# Altium schematic sheet DDR3_1.SchDoc
size A4; DocumentNumber: 13; SheetNumber: 13; SheetTotal: 47
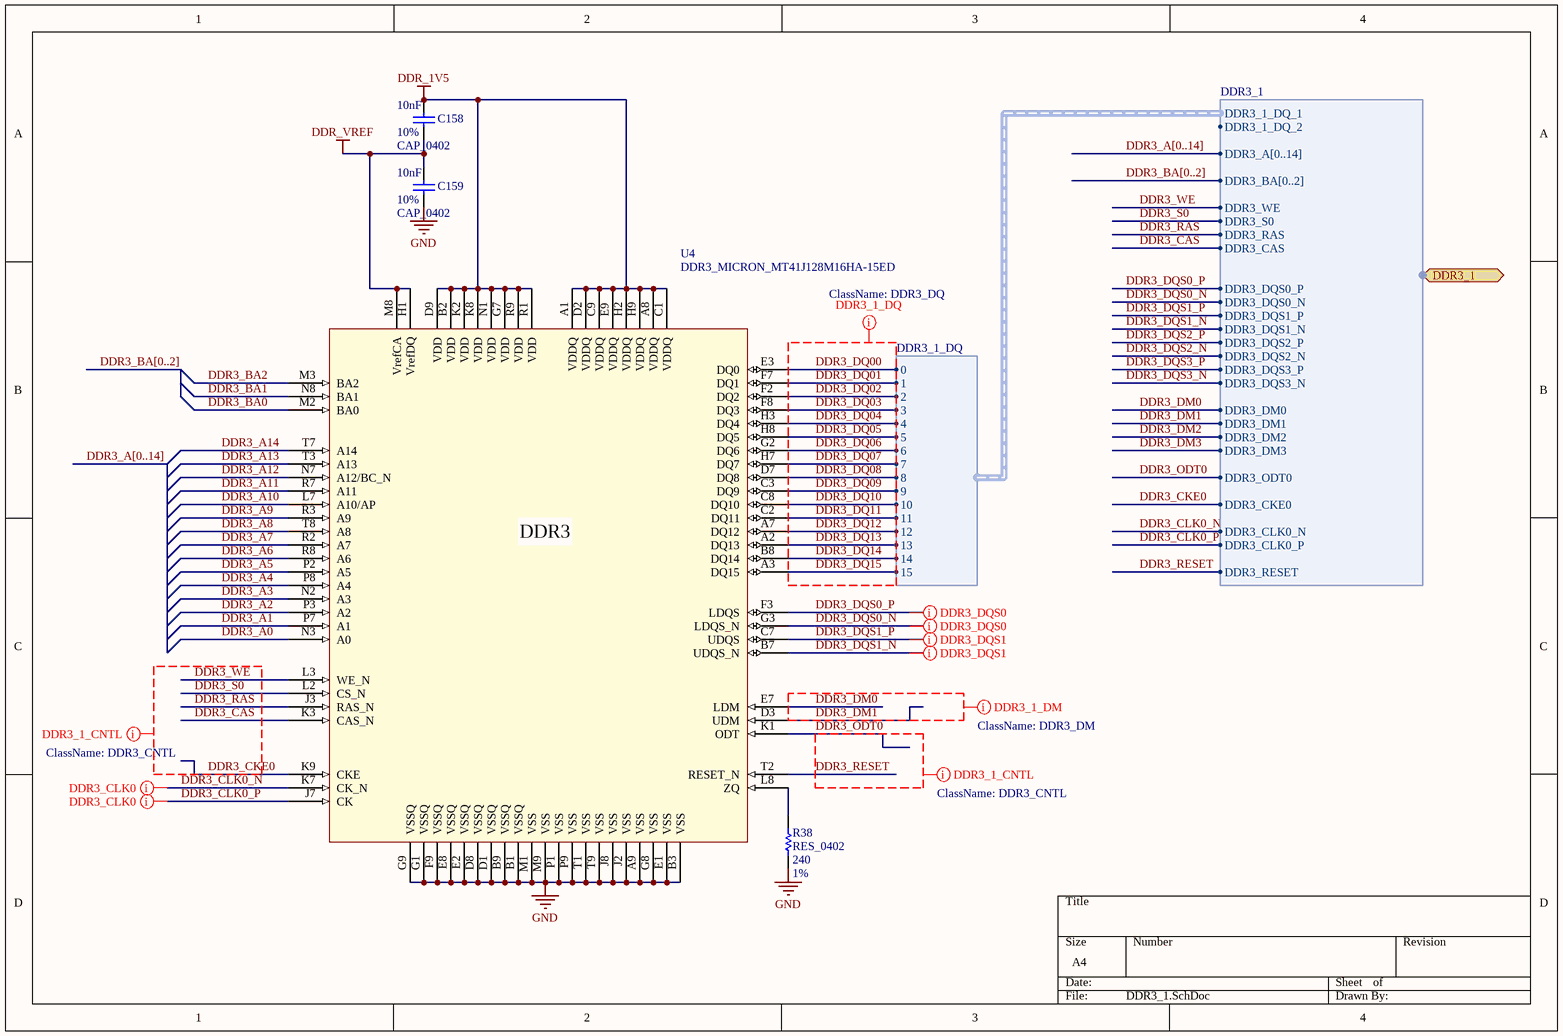
[diagram p0: DDR3_1.SchDoc]

## Parts
C158  CAP_0402  value 10nF  Tolerance: 10%  [CAPC0402(1005)60_N]
C159  CAP_0402  value 10nF  Tolerance: 10%  [CAPC0402(1005)60_N]
R38  RES_0402  value 240  Tolerance: 1%  [RESC0402(1005)_N]
U4  DDR3_MICRON_MT41J128M16HA-15ED  [DDR3_MICRON_MT41J128M16HA-15ED_FBGA96]

## Ports
DDR3_1 (harness DDR3_1)

## Harnesses
DDR3_1: DDR3_1_DQ_1, DDR3_1_DQ_2, DDR3_A[0..14], DDR3_BA[0..2], DDR3_WE, DDR3_S0, DDR3_RAS, DDR3_CAS, DDR3_DQS0_P, DDR3_DQS0_N, DDR3_DQS1_P, DDR3_DQS1_N, DDR3_DQS2_P, DDR3_DQS2_N, DDR3_DQS3_P, DDR3_DQS3_N, DDR3_DM0, DDR3_DM1, DDR3_DM2, DDR3_DM3, DDR3_ODT0, DDR3_CKE0, DDR3_CLK0_N, DDR3_CLK0_P, DDR3_RESET
DDR3_1_DQ: 0, 1, 2, 3, 4, 5, 6, 7, 8, 9, 10, 11, 12, 13, 14, 15

## Nets
DDR_1V5: C158.2 U4.A1(VDDQ) U4.A8(VDDQ) U4.B2(VDD) U4.C1(VDDQ) U4.C9(VDDQ) U4.D2(VDDQ) U4.D9(VDD) U4.E9(VDDQ) U4.G7(VDD) U4.H2(VDDQ) U4.H9(VDDQ) U4.K2(VDD) U4.K8(VDD) U4.N1(VDD) U4.R1(VDD) U4.R9(VDD)
DDR_VREF: C158.1 C159.2 U4.H1(VrefDQ) U4.M8(VrefCA)
GND: C159.1 R38.1 U4.A9(VSS) U4.B1(VSSQ) U4.B3(VSS) U4.B9(VSSQ) U4.D1(VSSQ) U4.D8(VSSQ) U4.E1(VSS) U4.E2(VSSQ) U4.E8(VSSQ) U4.F9(VSSQ) U4.G1(VSSQ) U4.G8(VSS) U4.G9(VSSQ) U4.J2(VSS) U4.J8(VSS) U4.M1(VSS) U4.M9(VSS) U4.P1(VSS) U4.P9(VSS) U4.T1(VSS) U4.T9(VSS)
DDR3_A0: U4.N3(A0)
DDR3_A1: U4.P7(A1)
DDR3_A2: U4.P3(A2)
DDR3_A3: U4.N2(A3)
DDR3_A4: U4.P8(A4)
DDR3_A5: U4.P2(A5)
DDR3_A6: U4.R8(A6)
DDR3_A7: U4.R2(A7)
DDR3_A8: U4.T8(A8)
DDR3_A9: U4.R3(A9)
DDR3_A10: U4.L7(A10/AP)
DDR3_A11: U4.R7(A11)
DDR3_A12: U4.N7(A12/BC_N)
DDR3_A13: U4.T3(A13)
DDR3_A14: U4.T7(A14)
DDR3_BA0: U4.M2(BA0)
DDR3_BA1: U4.N8(BA1)
DDR3_BA2: U4.M3(BA2)
DDR3_CAS: U4.K3(CAS_N) ; port DDR3_1.DDR3_CAS
DDR3_CKE0: U4.K9(CKE) ; port DDR3_1.DDR3_CKE0
DDR3_CLK0_N: U4.K7(CK_N) ; port DDR3_1.DDR3_CLK0_N
DDR3_CLK0_P: U4.J7(CK) ; port DDR3_1.DDR3_CLK0_P
DDR3_DM0: U4.E7(LDM) ; port DDR3_1.DDR3_DM0
DDR3_DM1: U4.D3(UDM) ; port DDR3_1.DDR3_DM1
DDR3_DM2: port DDR3_1.DDR3_DM2
DDR3_DM3: port DDR3_1.DDR3_DM3
DDR3_DQ00: U4.E3(DQ0) ; harness DDR3_1_DQ.0
DDR3_DQ01: U4.F7(DQ1) ; harness DDR3_1_DQ.1
DDR3_DQ02: U4.F2(DQ2) ; harness DDR3_1_DQ.2
DDR3_DQ03: U4.F8(DQ3) ; harness DDR3_1_DQ.3
DDR3_DQ04: U4.H3(DQ4) ; harness DDR3_1_DQ.4
DDR3_DQ05: U4.H8(DQ5) ; harness DDR3_1_DQ.5
DDR3_DQ06: U4.G2(DQ6) ; harness DDR3_1_DQ.6
DDR3_DQ07: U4.H7(DQ7) ; harness DDR3_1_DQ.7
DDR3_DQ08: U4.D7(DQ8) ; harness DDR3_1_DQ.8
DDR3_DQ09: U4.C3(DQ9) ; harness DDR3_1_DQ.9
DDR3_DQ10: U4.C8(DQ10) ; harness DDR3_1_DQ.10
DDR3_DQ11: U4.C2(DQ11) ; harness DDR3_1_DQ.11
DDR3_DQ12: U4.A7(DQ12) ; harness DDR3_1_DQ.12
DDR3_DQ13: U4.A2(DQ13) ; harness DDR3_1_DQ.13
DDR3_DQ14: U4.B8(DQ14) ; harness DDR3_1_DQ.14
DDR3_DQ15: U4.A3(DQ15) ; harness DDR3_1_DQ.15
DDR3_DQS0_N: U4.G3(LDQS_N) ; port DDR3_1.DDR3_DQS0_N
DDR3_DQS0_P: U4.F3(LDQS) ; port DDR3_1.DDR3_DQS0_P
DDR3_DQS1_N: U4.B7(UDQS_N) ; port DDR3_1.DDR3_DQS1_N
DDR3_DQS1_P: U4.C7(UDQS) ; port DDR3_1.DDR3_DQS1_P
DDR3_DQS2_N: port DDR3_1.DDR3_DQS2_N
DDR3_DQS2_P: port DDR3_1.DDR3_DQS2_P
DDR3_DQS3_N: port DDR3_1.DDR3_DQS3_N
DDR3_DQS3_P: port DDR3_1.DDR3_DQS3_P
DDR3_ODT0: U4.K1(ODT) ; port DDR3_1.DDR3_ODT0
DDR3_RAS: U4.J3(RAS_N) ; port DDR3_1.DDR3_RAS
DDR3_RESET: U4.T2(RESET_N) ; port DDR3_1.DDR3_RESET
DDR3_S0: U4.L2(CS_N) ; port DDR3_1.DDR3_S0
DDR3_WE: U4.L3(WE_N) ; port DDR3_1.DDR3_WE
NetR38_2: R38.2 U4.L8(ZQ)

## Buses and harness runs
bus DDR3_A[0..14]
bus DDR3_BA[0..2]

## Layout directives
differential pair: DDR3_CLK0_N, DDR3_CLK0_P, DDR3_DQS0_N, DDR3_DQS0_P, DDR3_DQS1_N, DDR3_DQS1_P
net class DDR3_DQ: DDR3_DQ00, DDR3_DQ01, DDR3_DQ02, DDR3_DQ03, DDR3_DQ04, DDR3_DQ05, DDR3_DQ06, DDR3_DQ07, DDR3_DQ08, DDR3_DQ09, DDR3_DQ10, DDR3_DQ11, DDR3_DQ12, DDR3_DQ13, DDR3_DQ14, DDR3_DQ15
net class DDR3_DM: DDR3_DM0, DDR3_DM1
net class DDR3_CNTL: DDR3_CAS, DDR3_CKE0, DDR3_ODT0, DDR3_RAS, DDR3_RESET, DDR3_S0, DDR3_WE

## Notes on the sheet
- (in symbol MT41J128M16HA-15E:D TR) DDR3

## Library data of the parts
C158 C159 = CAP_0402: 10000pF, ceramic, 10% 6.3V X5R, 0402; Part Number: GRM155R60J103KA01D; Manufacturer: Murata Electronics North America; Footprint Ref: CAPC0402(1005)60_N; Library Ref: CAP_0402
R38 = RES_0402: 240 ohm, 1% 1/16W, 0402; Part Number: CRCW0402240RFKED; Manufacturer: Vishay/Dale; Library Ref: RES_0402; Footprint Ref: RESC0402(1005)_N
U4 = MT41J128M16HA-15E:D TR: MT41J128M16HA-15E:D, DDR3 SDRAM 4Gb x4, x8, x16, FBGA96; Manufacturer: MICRON; Part Number: MT41J128M16HA-15E:D TR